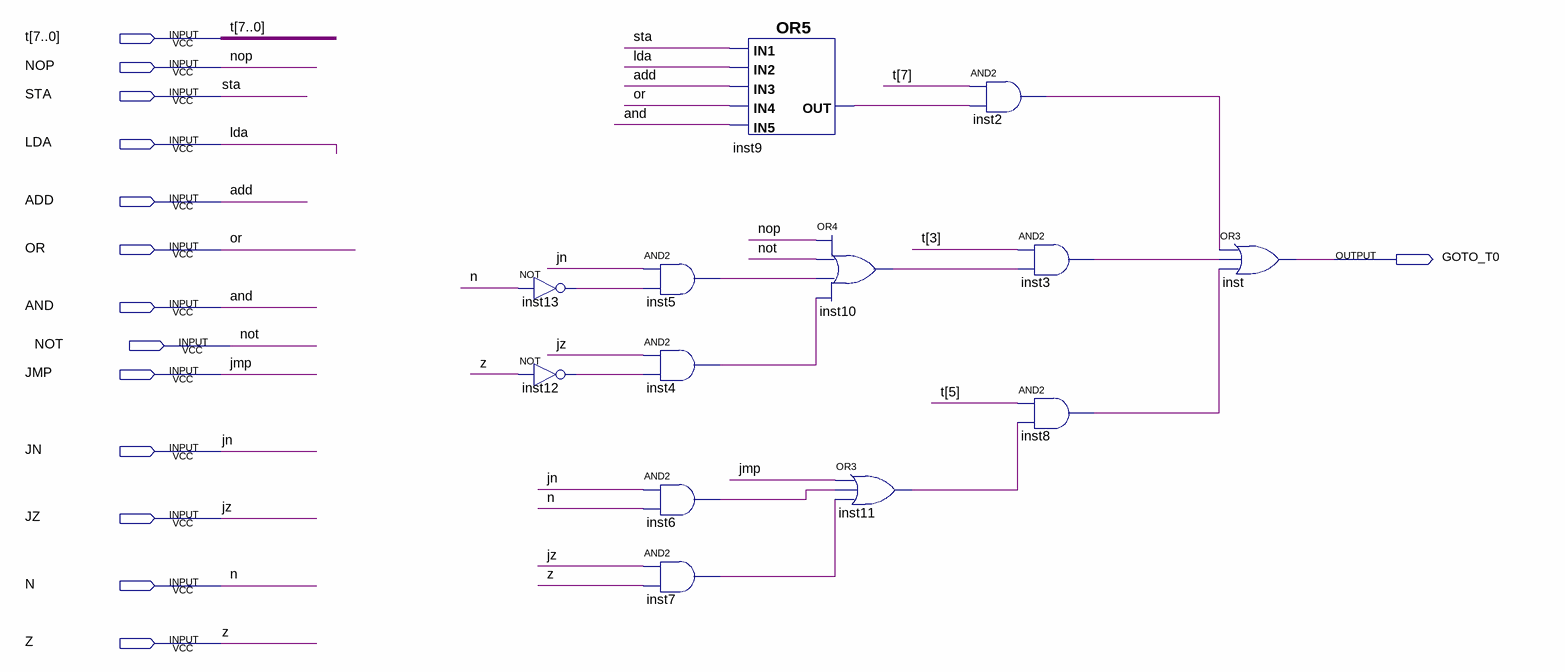
[diagram p0: schematic sheet]
// Quartus schematic GOTO_T0.bdf as structural Verilog: 13 symbols, 14 pins
module GOTO_T0 (
  input  [7:0] t,
  input  NOP,
  input  STA,
  input  LDA,
  input  ADD,
  input  OR,
  input  AND,
  input  NOT,
  input  JMP,
  input  JN,
  input  JZ,
  input  N,
  input  Z,
  output GOTO_T0
);

  wire inst2_out, inst3_out, inst4_out, inst5_out, inst6_out, inst7_out, inst8_out, inst9_out, inst10_out,
       inst11_out, inst12_out, inst13_out;

  not inst13 (inst13_out, N);
  not inst12 (inst12_out, Z);
  and inst5 (inst5_out, JN, inst13_out);
  and inst4 (inst4_out, JZ, inst12_out);
  and inst6 (inst6_out, JN, N);
  and inst7 (inst7_out, JZ, Z);
  or inst9 (inst9_out, STA, LDA, ADD, OR, AND);
  or inst10 (inst10_out, NOP, NOT, inst5_out, inst4_out);
  or inst11 (inst11_out, JMP, inst6_out, inst7_out);
  and inst2 (inst2_out, t[7], inst9_out);
  and inst3 (inst3_out, t[3], inst10_out);
  and inst8 (inst8_out, t[5], inst11_out);
  or inst (GOTO_T0, inst2_out, inst3_out, inst8_out);
endmodule
